# EAGLE design AguaC (EAGLE 7.5.0)
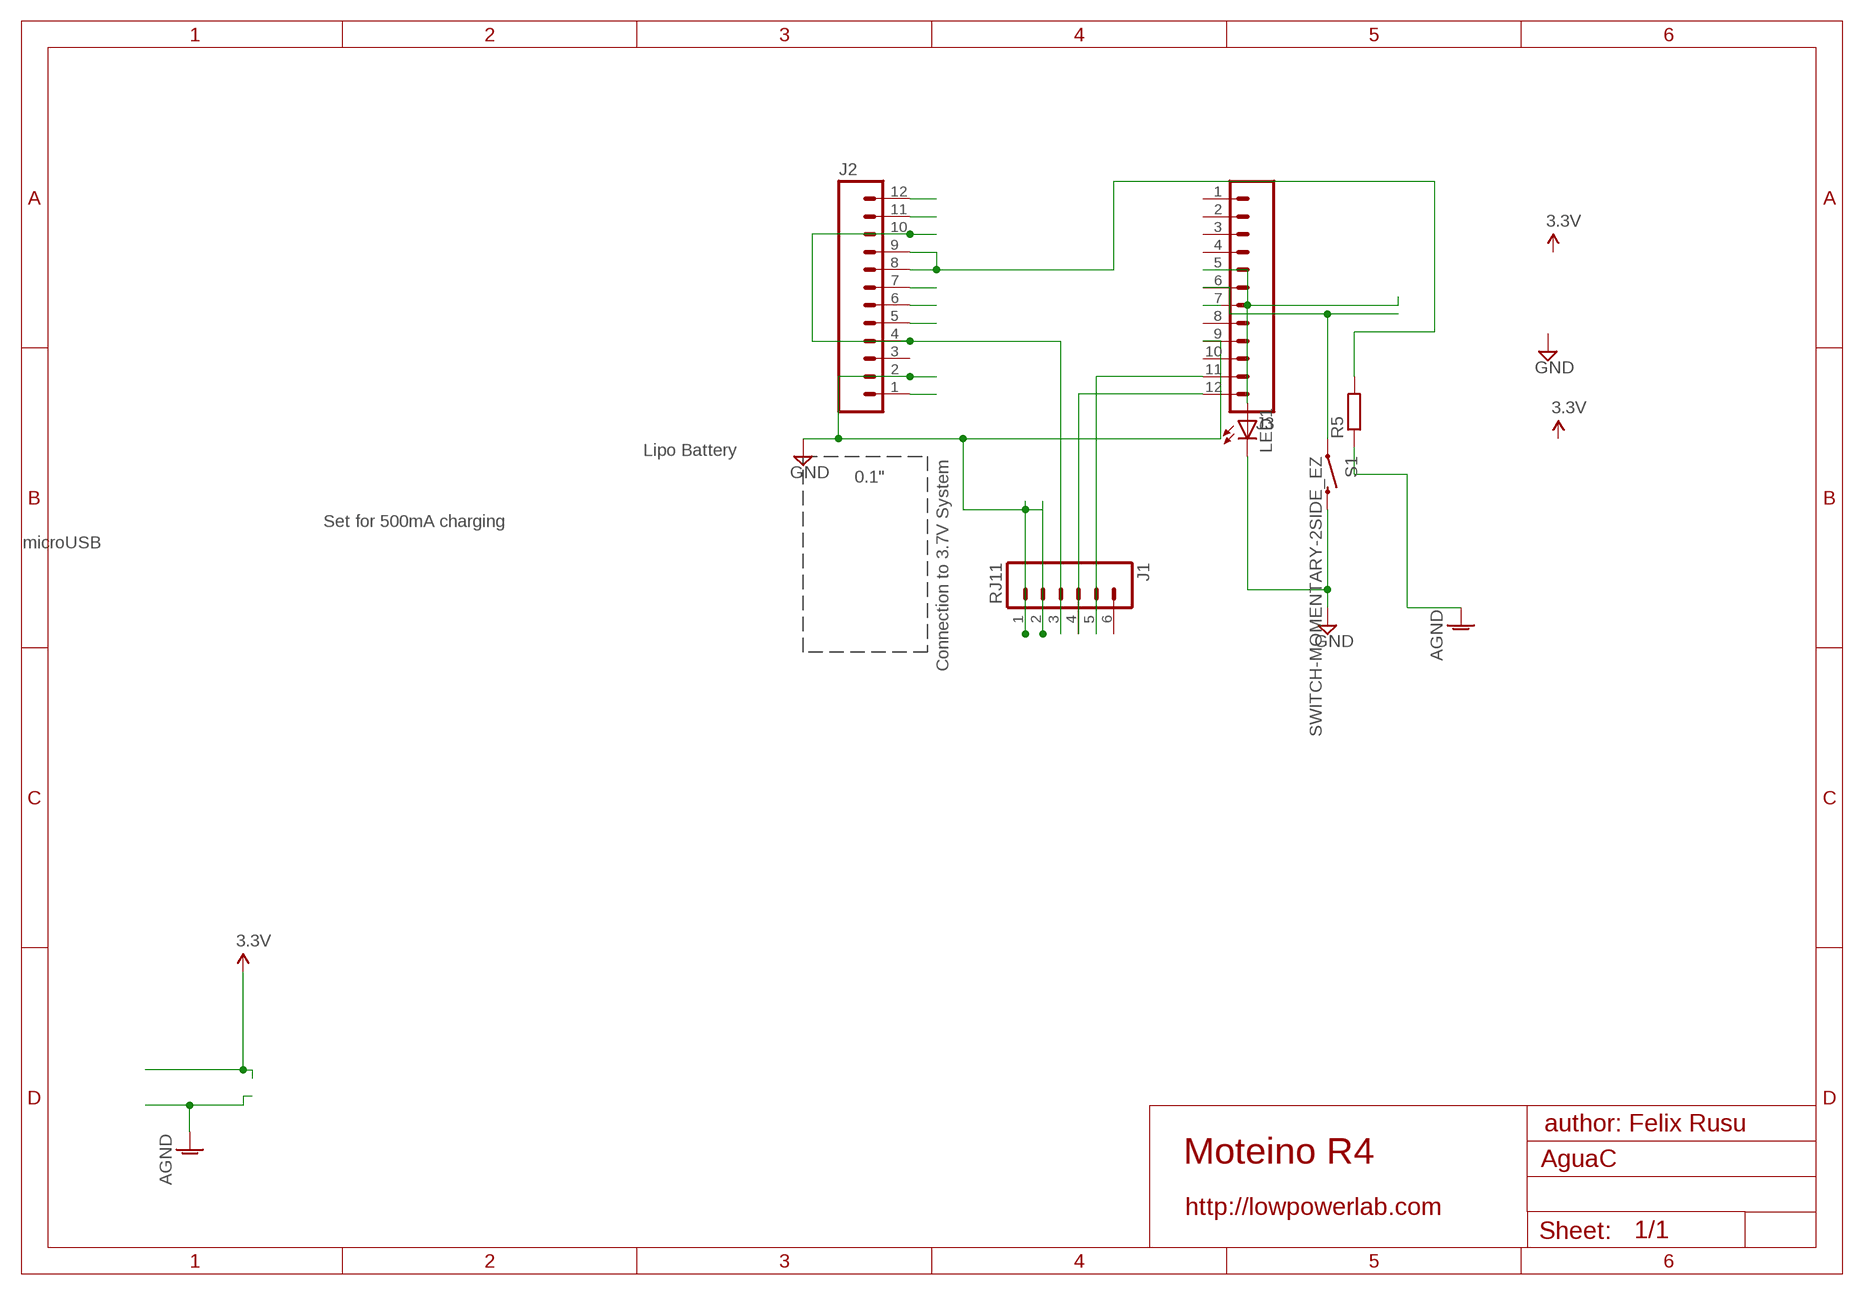
[diagram p0: schematic, sheet 1]

## Parts
J1  RJ11  RJ11-6PTH  [RJ11-6]
J2  M12PTH  [1X12]
J3  M12PTH  [1X12]
LED1  LED3MM  [LED3MM]
R5  R-EU_0204/7  [0204/7]
S1  SWITCH-MOMENTARY-2SIDE_EZ  [TACTILE-PTH-SIDEEZ]

## Nets
AGND [power]: R5.1
GND [power]: J1.1 J1.2 J2.2 J3.9 LED1.K(C) S1.2
N$1: J3.6 S1.1
N$2: J2.11
N$3: J3.5 LED1.A
N$4: J1.4 J3.12
N$5: J3.7
N$6: J1.5 J3.11
N$7: J2.1
N$9: J2.5
N$11: J2.6
N$12: J2.7
N$14: J2.8 J2.9 R5.2
N$17: J2.12
VIN: J1.3 J2.4 J2.10
Unconnected: J1.6 J2.3 J3.1 J3.2 J3.3 J3.4 J3.8 J3.10

## Notes on the sheet
- Lipo Battery
- 0.1"
- Set for 500mA charging
- microUSB
- Connection to 3.7V System
- author: Felix Rusu
- Moteino R4
- http://lowpowerlab.com

## Library data of the parts
J1 = SparkFun-Connectors:RJ11-6: RJ11 Jack Simple 6 pin RJ11 jack. Commonly found on CAT3 devices and Microchip programmers. SKU: PRT-00132; PROD_ID: CONN-08590
J2 J3 = SparkFun-Connectors:M12: Header 12 Standard 12-pin 0.1" header. Use with straight break away headers (SKU : PRT-00116), right angle break away headers (PRT-00553), swiss pins (PRT-00743), machine pins (PRT-00117), and female headers (PRT-00115).
LED1 = led:LED: LED OSRAM: - CHIPLED LG R971, LG N971, LY N971, LG Q971, LY Q971, LO R971, LY R971 LH N974, LH R974 LS Q976, LO Q976, LY Q976 LO Q996 - Hyper CHIPLED LW Q18S LB Q993, LB Q99A, LB R99A - SideLED LS A670, LO A670, LY A670, LG A670, LP A670 LB A673, LV A673, LT A673, LW A673 LH A674 LY A675 LS A676, LA A676, LO A676, LY A676, LW A676 LS A679, LY A679, LG A679 - Hyper Micro SIDELED® LS Y876, LA Y876, LO Y876, LY Y876 LT Y87S - SmartLED LW L88C, LW L88S LB L89C, LB L89S, LG L890 LS L89K, LO L89K, LY L89K LS L896, LA L896, LO L896, LY L896 - TOPLED LS T670, LO T670, LY T670, LG T670, LP T670 LSG T670, LSP T670, LSY T670, LOP T670, LYG T670 LG T671, LOG T671, LSG T671 LB T673, LV T673, LT T673, LW T673 LH T674 LS T676, LA T676, LO T676, LY T676, LB T676, LH T676, LSB T676, LW T676 LB T67C, LV T67C, LT T67C, LS T67K, LO T67K, LY T67K, LW E67C LS E67B, LA E67B, LO E67B, LY E67B, LB E67C, LV E67C, LT E67C LW T67C LS T679, LY T679, LG T679 LS T770, LO T770, LY T770, LG T770, LP T770 LB T773, LV T773, LT T773, LW T773 LH T774 LS E675, LA E675, LY E675, LS T675 LS T776, LA T776, LO T776, LY T776, LB T776 LHGB T686 LT T68C, LB T68C - Hyper Mini TOPLED® LB M676 - Mini TOPLED Santana® LG M470 LS M47K, LO M47K, LY M47K Source: http://www.osram.convergy.de LUXEON: - LUMILED® LXK2-PW12-R00, LXK2-PW12-S00, LXK2-PW14-U00, LXK2-PW14-V00 LXK2-PM12-R00, LXK2-PM12-S00, LXK2-PM14-U00 LXK2-PE12-Q00, LXK2-PE12-R00, LXK2-PE12-S00, LXK2-PE14-T00, LXK2-PE14-U00 LXK2-PB12-K00, LXK2-PB12-L00, LXK2-PB12-M00, LXK2-PB14-N00, LXK2-PB14-P00, LXK2-PB14-Q00 LXK2-PR12-L00, LXK2-PR12-M00, LXK2-PR14-Q00, LXK2-PR14-R00 LXK2-PD12-Q00, LXK2-PD12-R00, LXK2-PD12-S00 LXK2-PH12-R00, LXK2-PH12-S00 LXK2-PL12-P00, LXK2-PL12-Q00, LXK2-PL12-R00 Source: www.luxeon.com KINGBRIGHT: KA-3528ASYC Source: www.kingbright.com
R5 = rcl:R-EU_: RESISTOR, European symbol
S1 = SparkFun-Electromechanical:SWITCH-MOMENTARY-2: Various NO switches- pushbuttons, reed, etc

## Net classes
1 power: width 0.381 mm, clearance 0.254 mm

## Board
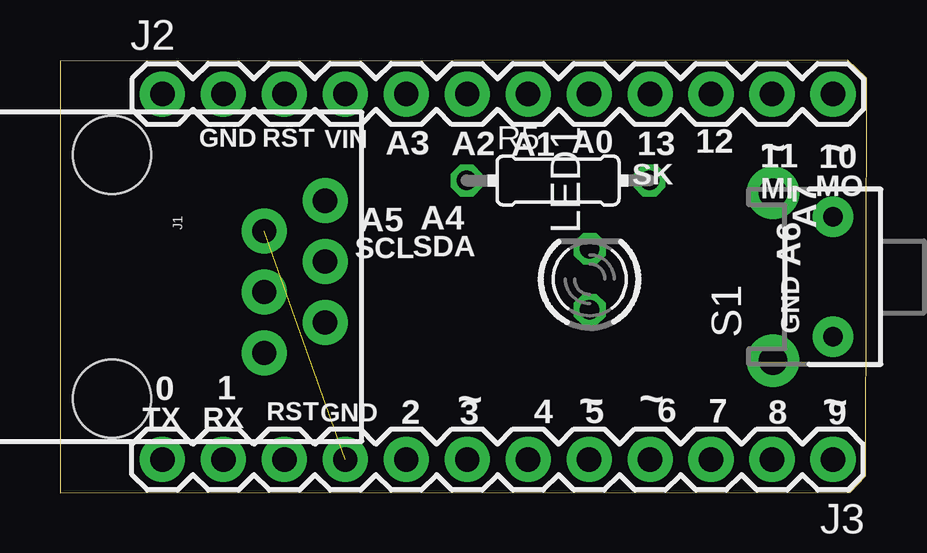
[diagram p1: board, top side]
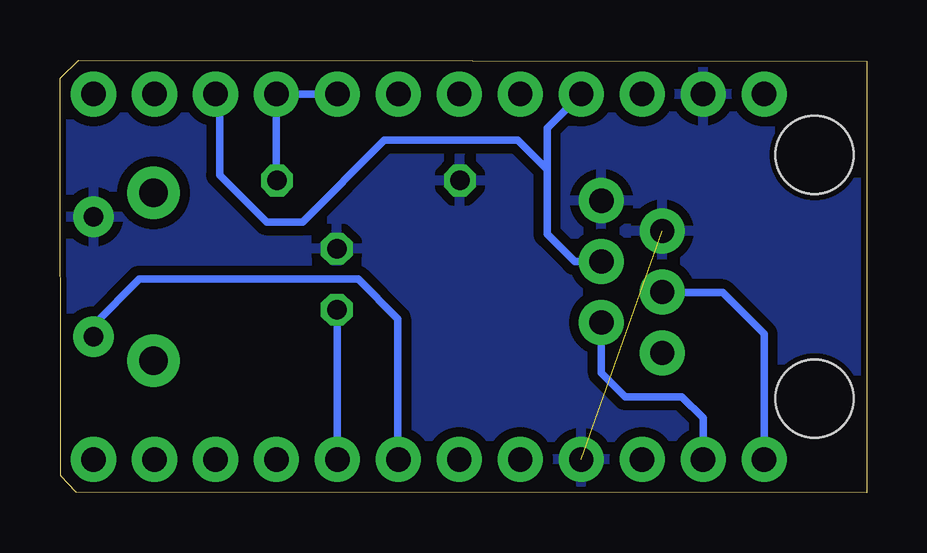
[diagram p2: board, bottom side, seen from below]

Size 33.6 x 18.06 mm. Coordinates in mm from the lower left corner, seen from the top.
Outline: 0,0 32.92,0.02 33.58,0.71 33.6,17.3 32.82,18.06 0,18.01 0,0
Copper layers (1*16): Top 0.035mm / dielectric 1.5mm / Bottom 0.035mm
Design rules "ITEADstudio_DRC *": minimum track width 6mil, minimum drill 12mil, track to track 16mil, track to pad 12mil, pad to pad 6mil, via to via 6mil, smd to smd 0mil, copper to edge 10mil, drill to drill 10mil, minimum pad ring 10mil, minimum via ring 6mil, stop-mask expansion 2mil, vias tented up to drill 100mil, thermal gap 15mil

### Footprints (pad centres in the part's own frame; a part is rotated, then mirrored left to right if it is on the bottom)
RJ11-6 = drill 1.016 pad 1.88: 1 -3.175,8.89; 2 -1.905,6.35; 3 -0.635,8.89; 4 0.635,6.35; 5 1.905,8.89; 6 3.175,6.35 | hole 3.251: -5.08,0; 5.08,0
1X12 = drill 1.016 pad 1.88: 1 0,0; 2 2.54,0; 3 5.08,0; 4 7.62,0; 5 10.16,0; 6 12.7,0; 7 15.24,0; 8 17.78,0; 9 20.32,0; 10 22.86,0; 11 25.4,0; 12 27.94,0
LED3MM = drill 0.813 octagon: A -1.27,0; K 1.27,0
0204/7 = drill 0.813 octagon: 1 -3.81,0; 2 3.81,0
TACTILE-PTH-SIDEEZ = drill 0.8 pad 1.7: 1 -2.5,0; 2 2.5,0 | drill 1.2 pad 2.2: ANCHOR1 -3.5,2.5; ANCHOR2 3.5,2.5

### Placement (x,y rotation side)
J1  2.16,9.02 270 top
J2  4.27,16.64 0 top
J3  32.21,1.4 180 top
LED1  22.07,8.92 90 top
R5  20.75,13.03 0 top
S1  32.21,9.02 90 top

### Tracks (layer width: path | path; a pad name or v marks a point on that pad's centre or on a via)
AGND
  pour Bottom: 0.1,17.91 33.35,17.91 33.71,0.08 0.23,0.15
GND  (1 unrouted)
  pour Bottom: 0.13,17.91 33.45,17.86 33.53,0.05 0.2,0.1
N$1
  Bottom 0.305: S1.1 32.21,7.01 30.3,8.91 21.18,8.91 19.53,7.26 19.53,1.42 J3.6
N$3
  Bottom 0.305: J3.5 22.05,7.62 LED1.A
N$4
  Bottom 0.305: J3.12 4.27,6.63 5.99,8.36 8.48,8.36 J1.4
N$6
  Bottom 0.305: J3.11 6.81,3.12 7.7,4.01 10.06,4.01 11.05,5 J1.5
N$14
  Bottom 0.305: J2.8 J2.9 24.59,13.06 R5.2
VIN
  Bottom 0.305: J1.3 12.17,9.65 13.31,10.8 13.31,13.49 | 13.31,13.49 13.31,15.21 J2.4 | J2.10 27.13,16.28 26.95,16.1 26.95,13.26 24.99,11.3 23.5,11.3 20.09,14.71 14.53,14.71 13.31,13.49

### Text on the board
_tsilk: VIN | A3 | A2 | A1 | 13 | 12 | ~ | GND | RST | A0 | 11 | 10 | ~ | A4 | SK | MI | A7 | MO | A5 | A6 | SCL | SDA | GND | 0 | 1 | 6 | TX | RX | RST | GND | 2 | ~ | 3 | 4 | ~ | 5 | ~ | 7 | 8 | ~ | 9